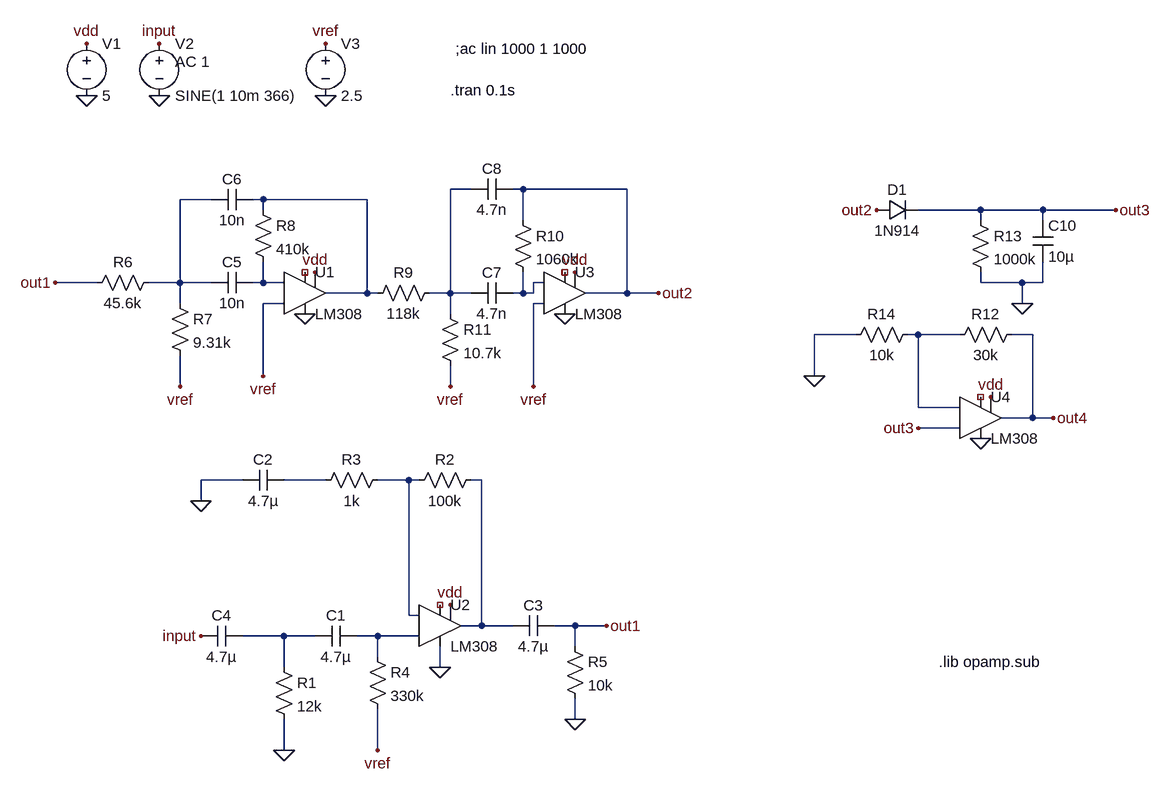
[diagram p0: schematic Radar_Full_Final_Shematic_LTSpice.asc]
Radar_Full_Final_Shematic_LTSpice.asc, the LTspice schematic file:
Version 4
SHEET 1 1576 956
WIRE 368 0 336 0
WIRE 448 0 432 0
WIRE 608 0 448 0
WIRE -32 16 -80 16
WIRE 48 16 32 16
WIRE 208 16 48 16
WIRE 48 32 48 16
WIRE 1152 32 1056 32
WIRE 1248 32 1152 32
WIRE 1360 32 1248 32
WIRE 448 48 448 0
WIRE 1152 48 1152 32
WIRE 1248 48 1248 32
WIRE -208 144 -272 144
WIRE -80 144 -80 16
WIRE -80 144 -128 144
WIRE -32 144 -80 144
WIRE 48 144 48 112
WIRE 48 144 32 144
WIRE 80 144 48 144
WIRE 480 144 464 144
WIRE 1152 144 1152 128
WIRE 1216 144 1152 144
WIRE 1248 144 1248 112
WIRE 1248 144 1216 144
WIRE 208 160 208 16
WIRE 208 160 144 160
WIRE 224 160 208 160
WIRE 336 160 336 0
WIRE 336 160 304 160
WIRE 368 160 336 160
WIRE 448 160 448 128
WIRE 448 160 432 160
WIRE 464 160 464 144
WIRE 464 160 448 160
WIRE 608 160 608 0
WIRE 608 160 544 160
WIRE 656 160 608 160
WIRE -80 176 -80 144
WIRE 80 176 48 176
WIRE 480 176 464 176
WIRE 1216 176 1216 144
WIRE 336 192 336 160
WIRE 960 224 896 224
WIRE 1056 224 1040 224
WIRE 1120 224 1056 224
WIRE 1232 224 1200 224
WIRE 48 288 48 176
WIRE 896 288 896 224
WIRE -80 304 -80 256
WIRE 336 304 336 272
WIRE 464 304 464 176
WIRE 1056 336 1056 224
WIRE 1120 336 1056 336
WIRE 1232 352 1232 224
WIRE 1232 352 1184 352
WIRE 1264 352 1232 352
WIRE 1120 368 1056 368
WIRE 16 448 -48 448
WIRE 144 448 80 448
WIRE 272 448 224 448
WIRE 288 448 272 448
WIRE 384 448 368 448
WIRE -48 480 -48 448
WIRE 272 656 272 448
WIRE 288 656 272 656
WIRE 384 672 384 448
WIRE 384 672 352 672
WIRE 432 672 384 672
WIRE 528 672 496 672
WIRE 576 672 528 672
WIRE 80 688 16 688
WIRE 128 688 80 688
WIRE 224 688 192 688
WIRE 288 688 224 688
WIRE 528 704 528 672
WIRE 224 720 224 688
WIRE 80 736 80 688
WIRE 320 736 320 704
WIRE 528 816 528 784
WIRE 80 864 80 816
WIRE 224 864 224 800
FLAG -224 -224 vdd
FLAG -224 -144 0
FLAG -112 -144 0
FLAG -112 -224 input
FLAG 144 -144 0
FLAG 144 -224 vref
FLAG 80 864 0
FLAG 320 736 0
FLAG -48 480 0
FLAG 528 816 0
FLAG 336 640 vdd
FLAG -48 688 input
FLAG 224 864 vref
FLAG 128 128 vdd
FLAG 112 192 0
FLAG 528 128 vdd
FLAG 512 192 0
FLAG -80 304 vref
FLAG 336 304 vref
FLAG 464 304 vref
FLAG 576 672 out1
FLAG -272 144 out1
FLAG 656 160 out2
FLAG 1216 176 0
FLAG 1360 32 out3
FLAG 48 288 vref
FLAG 992 32 out2
FLAG 1264 352 out4
FLAG 896 288 0
FLAG 1056 368 out3
FLAG 1152 384 0
FLAG 1168 320 vdd
SYMBOL OpAmps\\LM308 112 96 R0
SYMATTR InstName U1
SYMBOL voltage -224 -240 R0
WINDOW 123 0 0 Left 0
WINDOW 39 0 0 Left 0
SYMATTR InstName V1
SYMATTR Value 5
SYMBOL voltage -112 -240 R0
WINDOW 123 24 44 Left 2
WINDOW 39 0 0 Left 0
SYMATTR Value2 AC 1
SYMATTR InstName V2
SYMATTR Value SINE(1 10m 366)
SYMBOL voltage 144 -240 R0
WINDOW 123 0 0 Left 0
WINDOW 39 0 0 Left 0
SYMATTR InstName V3
SYMATTR Value 2.5
SYMBOL OpAmps\\LM308 320 608 R0
SYMATTR InstName U2
SYMBOL cap 192 672 R90
WINDOW 0 0 32 VBottom 2
WINDOW 3 32 32 VTop 2
SYMATTR InstName C1
SYMATTR Value 4.7µ
SYMBOL res 64 720 R0
SYMATTR InstName R1
SYMATTR Value 12k
SYMBOL res 384 432 R90
WINDOW 0 0 56 VBottom 2
WINDOW 3 32 56 VTop 2
SYMATTR InstName R2
SYMATTR Value 100k
SYMBOL res 240 432 R90
WINDOW 0 0 56 VBottom 2
WINDOW 3 32 56 VTop 2
SYMATTR InstName R3
SYMATTR Value 1k
SYMBOL cap 80 432 R90
WINDOW 0 0 32 VBottom 2
WINDOW 3 32 32 VTop 2
SYMATTR InstName C2
SYMATTR Value 4.7µ
SYMBOL res 208 704 R0
SYMATTR InstName R4
SYMATTR Value 330k
SYMBOL cap 496 656 R90
WINDOW 0 0 32 VBottom 2
WINDOW 3 32 32 VTop 2
SYMATTR InstName C3
SYMATTR Value 4.7µ
SYMBOL res 512 688 R0
SYMATTR InstName R5
SYMATTR Value 10k
SYMBOL cap 16 672 R90
WINDOW 0 0 32 VBottom 2
WINDOW 3 32 32 VTop 2
SYMATTR InstName C4
SYMATTR Value 4.7µ
SYMBOL OpAmps\\LM308 512 96 R0
SYMATTR InstName U3
SYMBOL res -112 128 R90
WINDOW 0 0 56 VBottom 2
WINDOW 3 32 56 VTop 2
SYMATTR InstName R6
SYMATTR Value 45.6k
SYMBOL res -96 160 R0
SYMATTR InstName R7
SYMATTR Value 9.31k
SYMBOL cap 32 128 R90
WINDOW 0 0 32 VBottom 2
WINDOW 3 32 32 VTop 2
SYMATTR InstName C5
SYMATTR Value 10n
SYMBOL cap 32 0 R90
WINDOW 0 0 32 VBottom 2
WINDOW 3 32 32 VTop 2
SYMATTR InstName C6
SYMATTR Value 10n
SYMBOL res 32 16 R0
SYMATTR InstName R8
SYMATTR Value 410k
SYMBOL res 320 144 R90
WINDOW 0 0 56 VBottom 2
WINDOW 3 32 56 VTop 2
SYMATTR InstName R9
SYMATTR Value 118k
SYMBOL cap 432 144 R90
WINDOW 0 0 32 VBottom 2
WINDOW 3 32 32 VTop 2
SYMATTR InstName C7
SYMATTR Value 4.7n
SYMBOL res 432 32 R0
SYMATTR InstName R10
SYMATTR Value 1060k
SYMBOL cap 432 -16 R90
WINDOW 0 0 32 VBottom 2
WINDOW 3 32 32 VTop 2
SYMATTR InstName C8
SYMATTR Value 4.7n
SYMBOL res 320 176 R0
SYMATTR InstName R11
SYMATTR Value 10.7k
SYMBOL res 1136 32 R0
SYMATTR InstName R13
SYMATTR Value 1000k
SYMBOL cap 1232 48 R0
SYMATTR InstName C10
SYMATTR Value 10µ
SYMBOL diode 992 48 R270
WINDOW 0 32 32 VTop 2
WINDOW 3 0 32 VBottom 2
SYMATTR InstName D1
SYMATTR Value 1N914
SYMBOL OpAmps\\LM308 1152 288 R0
SYMATTR InstName U4
SYMBOL res 1216 208 R90
WINDOW 0 0 56 VBottom 2
WINDOW 3 32 56 VTop 2
SYMATTR InstName R12
SYMATTR Value 30k
SYMBOL res 1056 208 R90
WINDOW 0 0 56 VBottom 2
WINDOW 3 32 56 VTop 2
SYMATTR InstName R14
SYMATTR Value 10k
TEXT 344 -216 Left 2 !;ac lin 1000 1 1000
TEXT 336 -152 Left 2 !.tran 0.1s
TEXT 1088 728 Left 2 !.lib opamp.sub

The netlist it stands for:
* Radar_Full_Final_Shematic_LTSpice.asc
XU1 vref N004 vdd 0 N003 NC_01 NC_02 LT1008
V1 vdd 0 5
V2 input 0 SINE(1 10m 366) AC 1
V3 vref 0 2.5
XU2 N011 N008 vdd 0 N009 NC_03 NC_04 LT1008
C1 N011 N010 4.7µ
R1 N010 0 12k
R2 N009 N008 100k
R3 N008 N007 1k
C2 N007 0 4.7µ
R4 N011 vref 330k
C3 out1 N009 4.7µ
R5 out1 0 10k
C4 N010 input 4.7µ
XU3 vref N005 vdd 0 out2 NC_05 NC_06 LT1008
R6 N002 out1 45.6k
R7 N002 vref 9.31k
C5 N004 N002 10n
C6 N003 N002 10n
R8 N003 N004 410k
R9 N001 N003 118k
C7 N005 N001 4.7n
R10 out2 N005 1060k
C8 out2 N001 4.7n
R11 N001 vref 10.7k
R13 out3 0 1000k
C10 out3 0 10µ
D1 out2 out3 1N914
XU4 out3 N006 vdd 0 out4 NC_07 NC_08 LT1008
R12 out4 N006 30k
R14 N006 0 10k
.model D D
.lib standard.dio
;ac lin 1000 1 1000
.tran 0.1s
.lib opamp.sub
.lib LTC.lib
.backanno
.end